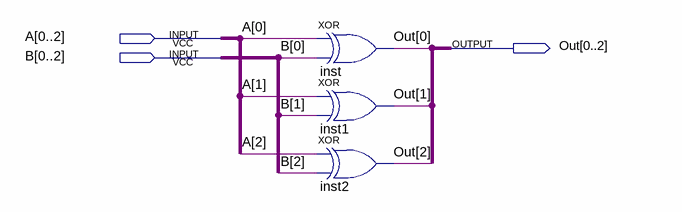
[diagram p0: schematic sheet]
// Quartus schematic xor_bus3.bdf as structural Verilog: 3 symbols, 3 pins
module xor_bus3 (
  input  [0:2] A,
  input  [0:2] B,
  output [0:2] Out
);

  xor inst (Out[0], A[0], B[0]);
  xor inst1 (Out[1], A[1], B[1]);
  xor inst2 (Out[2], A[2], B[2]);
endmodule
